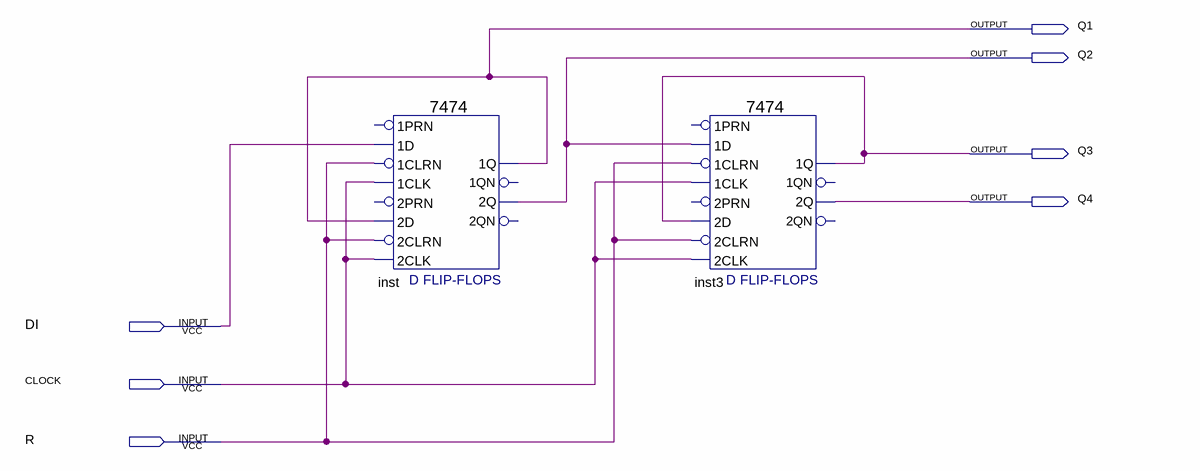
[diagram p0: schematic sheet]
// Quartus schematic ex6.bdf as structural Verilog: 2 symbols, 7 pins
module ex6 (
  input  DI,
  input  CLOCK,
  input  R,
  output Q1,
  output Q2,
  output Q3,
  output Q4
);

  \7474  inst (
    .\2D (Q1), .\1CLK (CLOCK), .\1D (DI), .\2CLK (CLOCK), .\2CLRN (R), .\1CLRN (R), .\2Q (Q2), .\1Q (Q1));  // open: 2PRN, 1PRN, 1QN, 2QN
  \7474  inst3 (
    .\2D (Q3), .\1CLK (CLOCK), .\1D (Q2), .\2CLK (CLOCK), .\2CLRN (R), .\1CLRN (R), .\2Q (Q4), .\1Q (Q3));  // open: 2PRN, 1PRN, 1QN, 2QN
endmodule
